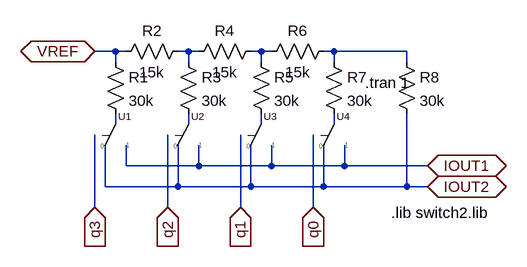
[diagram p0: schematic dac4_R2R.asc]
dac4_R2R.asc, the LTspice schematic file:
Version 4
SHEET 1 880 680
WIRE 128 112 96 112
WIRE 144 112 128 112
WIRE 240 112 224 112
WIRE 256 112 240 112
WIRE 352 112 336 112
WIRE 368 112 352 112
WIRE 464 112 448 112
WIRE 576 112 464 112
WIRE 128 128 128 112
WIRE 240 128 240 112
WIRE 352 128 352 112
WIRE 464 128 464 112
WIRE 576 128 576 112
WIRE 128 224 128 208
WIRE 240 224 240 208
WIRE 352 224 352 208
WIRE 464 224 464 208
WIRE 144 288 144 256
WIRE 256 288 256 256
WIRE 256 288 144 288
WIRE 368 288 368 256
WIRE 368 288 256 288
WIRE 480 288 480 256
WIRE 480 288 368 288
WIRE 608 288 480 288
WIRE 112 320 112 256
WIRE 224 320 224 256
WIRE 224 320 112 320
WIRE 336 320 336 256
WIRE 336 320 224 320
WIRE 448 320 448 256
WIRE 448 320 336 320
WIRE 576 320 576 208
WIRE 576 320 448 320
WIRE 608 320 576 320
WIRE 96 352 96 240
WIRE 208 352 208 240
WIRE 320 352 320 240
WIRE 432 352 432 240
FLAG 96 112 VREF
IOPIN 96 112 BiDir
FLAG 608 288 IOUT1
IOPIN 608 288 BiDir
FLAG 608 320 IOUT2
IOPIN 608 320 BiDir
FLAG 432 352 q0
IOPIN 432 352 In
FLAG 320 352 q1
IOPIN 320 352 In
FLAG 208 352 q2
IOPIN 208 352 In
FLAG 96 352 q3
IOPIN 96 352 In
SYMBOL res 112 112 R0
SYMATTR InstName R1
SYMATTR Value 30k
SYMBOL res 240 96 R90
WINDOW 0 0 56 VBottom 2
WINDOW 3 32 56 VTop 2
SYMATTR InstName R2
SYMATTR Value 15k
SYMBOL res 240 128 R270
WINDOW 0 32 56 VTop 2
WINDOW 3 0 56 VBottom 2
SYMATTR InstName R4
SYMATTR Value 15k
SYMBOL res 464 96 R90
WINDOW 0 0 56 VBottom 2
WINDOW 3 32 56 VTop 2
SYMATTR InstName R6
SYMATTR Value 15k
SYMBOL res 224 112 R0
SYMATTR InstName R3
SYMATTR Value 30k
SYMBOL res 336 112 R0
SYMATTR InstName R5
SYMATTR Value 30k
SYMBOL res 448 112 R0
SYMATTR InstName R7
SYMATTR Value 30k
SYMBOL res 560 112 R0
SYMATTR InstName R8
SYMATTR Value 30k
SYMBOL switch2 128 240 R0
SYMATTR InstName U1
SYMBOL switch2 240 240 R0
SYMATTR InstName U2
SYMBOL switch2 352 240 R0
SYMATTR InstName U3
SYMBOL switch2 464 240 R0
SYMATTR InstName U4
TEXT 552 360 Left 2 !.lib switch2.lib
TEXT 512 160 Left 2 !.tran 1

The netlist it stands for:
* dac4_R2R.asc
R1 VREF N004 30k
R2 N001 VREF 15k
R4 N001 N002 15k
R6 N003 N002 15k
R3 N001 N005 30k
R5 N002 N006 30k
R7 N003 N007 30k
R8 N003 IOUT2 30k
XU1 N004 IOUT2 IOUT1 q3 switch2  ; pins p1 p2 p3 bit
XU2 N005 IOUT2 IOUT1 q2 switch2  ; pins p1 p2 p3 bit
XU3 N006 IOUT2 IOUT1 q1 switch2  ; pins p1 p2 p3 bit
XU4 N007 IOUT2 IOUT1 q0 switch2  ; pins p1 p2 p3 bit
.lib switch2.lib
.tran 1
.backanno
.end